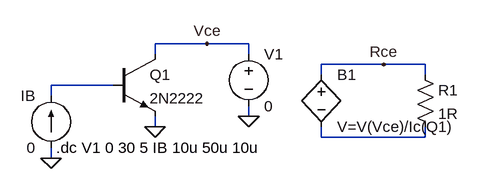
[diagram p0: schematic Transistor 2N2222 Curvas.asc]
Transistor 2N2222 Curvas.asc, the LTspice schematic file:
Version 4
SHEET 1 880 680
WIRE 320 80 240 80
WIRE 384 80 320 80
WIRE 240 96 240 80
WIRE 384 96 384 80
WIRE 592 112 496 112
WIRE 656 112 592 112
WIRE 496 128 496 112
WIRE 656 128 656 112
WIRE 176 144 80 144
WIRE 80 160 80 144
WIRE 384 192 384 176
WIRE 240 208 240 192
WIRE 496 224 496 208
WIRE 656 224 656 208
WIRE 656 224 496 224
WIRE 80 256 80 240
FLAG 384 192 0
FLAG 240 208 0
FLAG 80 256 0
FLAG 592 112 Rce
FLAG 320 80 Vce
SYMBOL npn 176 96 R0
SYMATTR InstName Q1
SYMATTR Value 2N2222
SYMBOL voltage 384 80 R0
WINDOW 123 0 0 Left 0
WINDOW 39 0 0 Left 0
SYMATTR InstName V1
SYMATTR Value 0
SYMBOL current 80 240 R180
WINDOW 0 24 80 Left 2
WINDOW 3 24 0 Left 2
WINDOW 123 0 0 Left 0
WINDOW 39 0 0 Left 0
SYMATTR InstName IB
SYMATTR Value 0
SYMBOL bv 496 112 R0
SYMATTR InstName B1
SYMATTR Value V=V(Vce)/Ic(Q1)
SYMBOL res 640 112 R0
SYMATTR InstName R1
SYMATTR Value 1R
TEXT 88 240 Left 2 !.dc V1 0 30 5 IB 10u 50u 10u

The netlist it stands for:
* Transistor 2N2222 Curvas.asc
Q1 Vce N001 0 0 2N2222
V1 Vce 0 0
IB 0 N001 0
B1 Rce N002 V=V(Vce)/Ic(Q1)
R1 Rce N002 1R
.model NPN NPN
.model PNP PNP
.lib standard.bjt
.dc V1 0 30 5 IB 10u 50u 10u
.backanno
.end